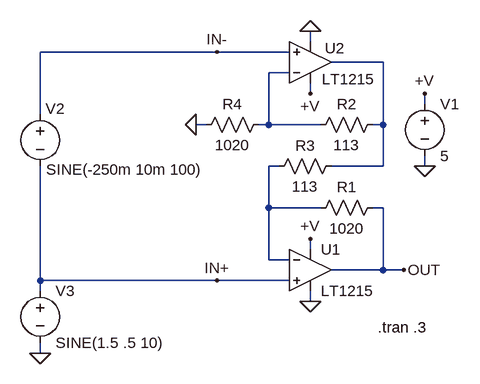
[diagram p0: schematic 1215.asc]
1215.asc, the LTspice schematic file:
Version 4
SHEET 1 896 680
WIRE 192 -224 192 -240
WIRE 48 -208 -224 -208
WIRE 160 -208 48 -208
WIRE 304 -192 224 -192
WIRE 160 -176 128 -176
WIRE 192 -144 192 -160
WIRE 368 -128 368 -144
WIRE -224 -112 -224 -208
WIRE 32 -96 16 -96
WIRE 128 -96 128 -176
WIRE 128 -96 112 -96
WIRE 208 -96 128 -96
WIRE 304 -96 304 -192
WIRE 304 -96 288 -96
WIRE 144 -32 128 -32
WIRE 304 -32 304 -96
WIRE 304 -32 224 -32
WIRE 368 -32 368 -48
WIRE 128 32 128 -32
WIRE 208 32 128 32
WIRE 304 32 288 32
WIRE 192 96 192 80
WIRE 128 112 128 32
WIRE 160 112 128 112
WIRE 304 128 304 32
WIRE 304 128 224 128
WIRE 336 128 304 128
WIRE -224 144 -224 -32
WIRE 48 144 -224 144
WIRE 160 144 48 144
WIRE -224 160 -224 144
WIRE 192 176 192 160
WIRE -224 256 -224 240
FLAG 368 -32 0
FLAG 192 80 +V
FLAG 368 -144 +V
FLAG -224 256 0
FLAG 192 176 0
FLAG 192 -144 +V
FLAG 192 -240 0
FLAG 16 -96 0
FLAG 336 128 OUT
FLAG 48 -208 IN-
FLAG 48 144 IN+
SYMBOL voltage 368 -144 R0
SYMATTR InstName V1
SYMATTR Value 5
SYMBOL voltage -224 -128 R0
WINDOW 0 8 7 Left 2
WINDOW 3 9 101 Left 2
SYMATTR InstName V2
SYMATTR Value SINE(-250m 10m 100)
SYMBOL opamps\\LT1215 192 64 R0
SYMATTR InstName U1
SYMBOL opamps\\LT1215 192 -128 M180
WINDOW 0 22 86 Left 2
WINDOW 3 18 38 Left 2
SYMATTR InstName U2
SYMBOL res 304 16 R90
WINDOW 0 0 56 VBottom 2
WINDOW 3 32 56 VTop 2
SYMATTR InstName R1
SYMATTR Value 1020
SYMBOL res 304 -112 R90
WINDOW 0 0 56 VBottom 2
WINDOW 3 32 56 VTop 2
SYMATTR InstName R2
SYMATTR Value 113
SYMBOL res 240 -48 R90
WINDOW 0 0 56 VBottom 2
WINDOW 3 32 56 VTop 2
SYMATTR InstName R3
SYMATTR Value 113
SYMBOL res 128 -112 R90
WINDOW 0 0 56 VBottom 2
WINDOW 3 32 56 VTop 2
SYMATTR InstName R4
SYMATTR Value 1020
SYMBOL voltage -224 144 R0
SYMATTR InstName V3
SYMATTR Value SINE(1.5 .5 10)
TEXT 296 216 Left 2 !.tran .3

The netlist it stands for:
* 1215.asc
V1 +V 0 5
V2 IN- IN+ SINE(-250m 10m 100)
XU1 IN+ N003 +V 0 OUT LT1215  ; pins In+ In- V+ V- OUT
XU2 IN- N002 +V 0 N001 LT1215  ; pins In+ In- V+ V- OUT
R1 OUT N003 1020
R2 N001 N002 113
R3 N001 N003 113
R4 N002 0 1020
V3 IN+ 0 SINE(1.5 .5 10)
.tran .3
.lib LTC.lib
.backanno
.end